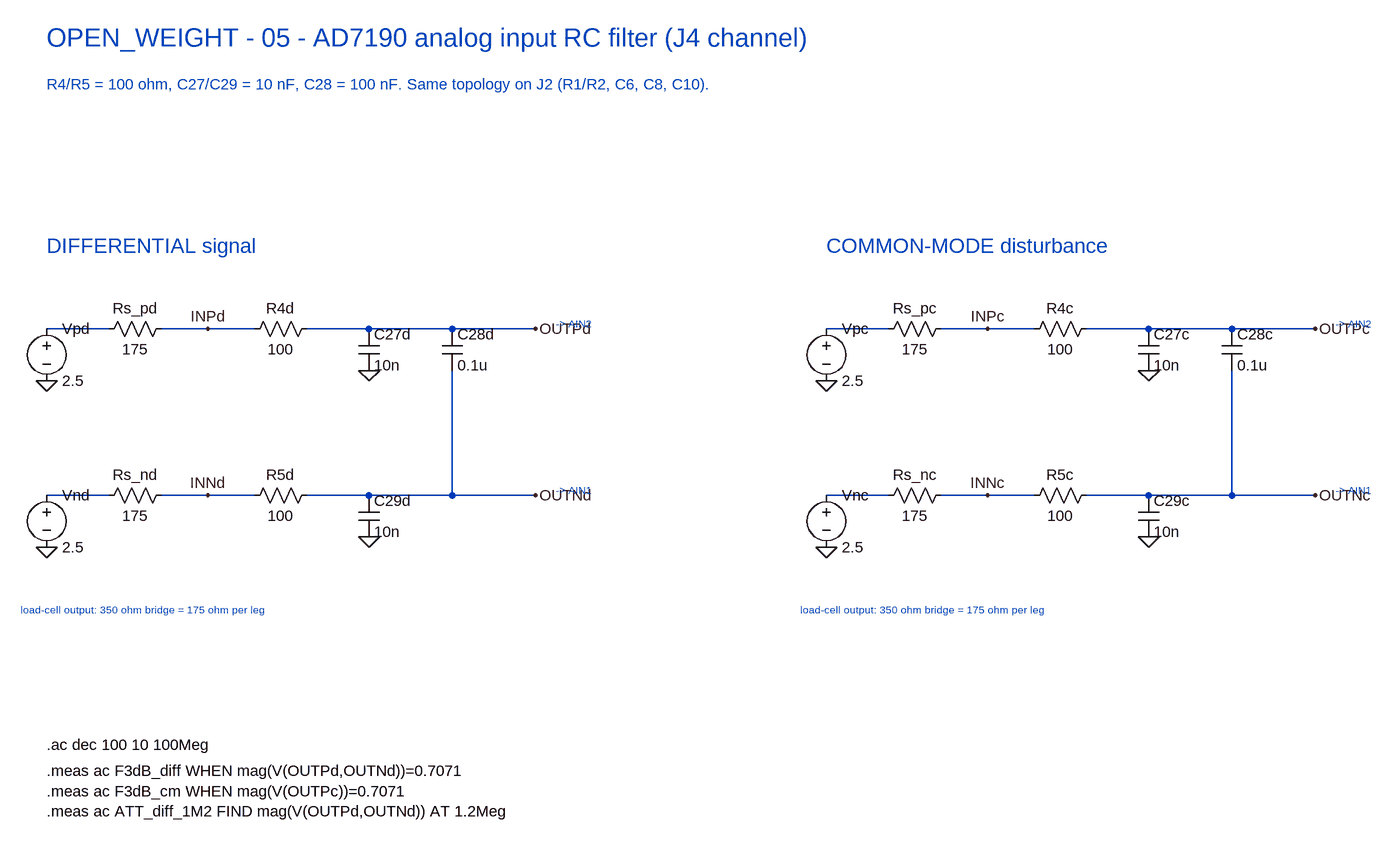
[diagram p0: schematic 05_AD7190_Input_Filter.asc]
05_AD7190_Input_Filter.asc, the LTspice schematic file:
Version 4
SHEET 1 2000 900
WIRE 0 0 96 0
WIRE 176 0 248 0
WIRE 248 0 320 0
WIRE 400 0 496 0
WIRE 496 0 624 0
WIRE 624 0 752 0
WIRE 0 256 96 256
WIRE 176 256 248 256
WIRE 248 256 320 256
WIRE 400 256 496 256
WIRE 496 256 624 256
WIRE 624 256 752 256
WIRE 624 64 624 256
WIRE 1200 0 1296 0
WIRE 1376 0 1448 0
WIRE 1448 0 1520 0
WIRE 1600 0 1696 0
WIRE 1696 0 1824 0
WIRE 1824 0 1952 0
WIRE 1200 256 1296 256
WIRE 1376 256 1448 256
WIRE 1448 256 1520 256
WIRE 1600 256 1696 256
WIRE 1696 256 1824 256
WIRE 1824 256 1952 256
WIRE 1824 64 1824 256
FLAG 0 80 0
FLAG 248 0 INPd
FLAG 752 0 OUTPd
FLAG 0 336 0
FLAG 248 256 INNd
FLAG 752 256 OUTNd
FLAG 496 64 0
FLAG 496 320 0
FLAG 1200 80 0
FLAG 1448 0 INPc
FLAG 1952 0 OUTPc
FLAG 1200 336 0
FLAG 1448 256 INNc
FLAG 1952 256 OUTNc
FLAG 1696 64 0
FLAG 1696 320 0
SYMBOL voltage 0 -16 R0
SYMATTR InstName Vpd
SYMATTR Value 2.5
SYMATTR Value2 AC 0.5
SYMBOL res 80 16 R270
WINDOW 0 32 56 VTop 2
WINDOW 3 0 56 VBottom 2
SYMATTR InstName Rs_pd
SYMATTR Value 175
SYMBOL res 304 16 R270
WINDOW 0 32 56 VTop 2
WINDOW 3 0 56 VBottom 2
SYMATTR InstName R4d
SYMATTR Value 100
SYMBOL voltage 0 240 R0
SYMATTR InstName Vnd
SYMATTR Value 2.5
SYMATTR Value2 AC 0.5 180
SYMBOL res 80 272 R270
WINDOW 0 32 56 VTop 2
WINDOW 3 0 56 VBottom 2
SYMATTR InstName Rs_nd
SYMATTR Value 175
SYMBOL res 304 272 R270
WINDOW 0 32 56 VTop 2
WINDOW 3 0 56 VBottom 2
SYMATTR InstName R5d
SYMATTR Value 100
SYMBOL cap 480 0 R0
SYMATTR InstName C27d
SYMATTR Value 10n
SYMBOL cap 608 0 R0
SYMATTR InstName C28d
SYMATTR Value 0.1u
SYMBOL cap 480 256 R0
SYMATTR InstName C29d
SYMATTR Value 10n
SYMBOL voltage 1200 -16 R0
SYMATTR InstName Vpc
SYMATTR Value 2.5
SYMATTR Value2 AC 1
SYMBOL res 1280 16 R270
WINDOW 0 32 56 VTop 2
WINDOW 3 0 56 VBottom 2
SYMATTR InstName Rs_pc
SYMATTR Value 175
SYMBOL res 1504 16 R270
WINDOW 0 32 56 VTop 2
WINDOW 3 0 56 VBottom 2
SYMATTR InstName R4c
SYMATTR Value 100
SYMBOL voltage 1200 240 R0
SYMATTR InstName Vnc
SYMATTR Value 2.5
SYMATTR Value2 AC 1
SYMBOL res 1280 272 R270
WINDOW 0 32 56 VTop 2
WINDOW 3 0 56 VBottom 2
SYMATTR InstName Rs_nc
SYMATTR Value 175
SYMBOL res 1504 272 R270
WINDOW 0 32 56 VTop 2
WINDOW 3 0 56 VBottom 2
SYMATTR InstName R5c
SYMATTR Value 100
SYMBOL cap 1680 0 R0
SYMATTR InstName C27c
SYMATTR Value 10n
SYMBOL cap 1808 0 R0
SYMATTR InstName C28c
SYMATTR Value 0.1u
SYMBOL cap 1680 256 R0
SYMATTR InstName C29c
SYMATTR Value 10n
TEXT 0 -448 Left 4 ;OPEN_WEIGHT - 05 - AD7190 analog input RC filter (J4 channel)
TEXT 0 -376 Left 2 ;R4/R5 = 100 ohm, C27/C29 = 10 nF, C28 = 100 nF. Same topology on J2 (R1/R2, C6, C8, C10).
TEXT 784 -8 Left 1 ;-> AIN2
TEXT 784 248 Left 1 ;-> AIN1
TEXT -40 432 Left 1 ;load-cell output: 350 ohm bridge = 175 ohm per leg
TEXT 0 -128 Left 3 ;DIFFERENTIAL signal
TEXT 1984 -8 Left 1 ;-> AIN2
TEXT 1984 248 Left 1 ;-> AIN1
TEXT 1160 432 Left 1 ;load-cell output: 350 ohm bridge = 175 ohm per leg
TEXT 1200 -128 Left 3 ;COMMON-MODE disturbance
TEXT 0 640 Left 2 !.ac dec 100 10 100Meg
TEXT 0 680 Left 2 !.meas ac F3dB_diff WHEN mag(V(OUTPd,OUTNd))=0.7071\n.meas ac F3dB_cm WHEN mag(V(OUTPc))=0.7071\n.meas ac ATT_diff_1M2 FIND mag(V(OUTPd,OUTNd)) AT 1.2Meg

The netlist it stands for:
* 05_AD7190_Input_Filter.asc
Vpd N001 0 2.5 AC 0.5
Rs_pd N001 INPd 175
R4d INPd OUTPd 100
Vnd N002 0 2.5 AC 0.5 180
Rs_nd N002 INNd 175
R5d INNd OUTNd 100
C27d OUTPd 0 10n
C28d OUTPd OUTNd 0.1u
C29d OUTNd 0 10n
Vpc N003 0 2.5 AC 1
Rs_pc N003 INPc 175
R4c INPc OUTPc 100
Vnc N004 0 2.5 AC 1
Rs_nc N004 INNc 175
R5c INNc OUTNc 100
C27c OUTPc 0 10n
C28c OUTPc OUTNc 0.1u
C29c OUTNc 0 10n
* OPEN_WEIGHT - 05 - AD7190 analog input RC filter (J4 channel)
* R4/R5 = 100 ohm, C27/C29 = 10 nF, C28 = 100 nF. Same topology on J2 (R1/R2, C6, C8, C10).
* -> AIN2
* -> AIN1
* load-cell output: 350 ohm bridge = 175 ohm per leg
* DIFFERENTIAL signal
* -> AIN2
* -> AIN1
* load-cell output: 350 ohm bridge = 175 ohm per leg
* COMMON-MODE disturbance
.ac dec 100 10 100Meg
.meas ac F3dB_diff WHEN mag(V(OUTPd,OUTNd))=0.7071
.meas ac F3dB_cm WHEN mag(V(OUTPc))=0.7071
.meas ac ATT_diff_1M2 FIND mag(V(OUTPd,OUTNd)) AT 1.2Meg
.backanno
.end